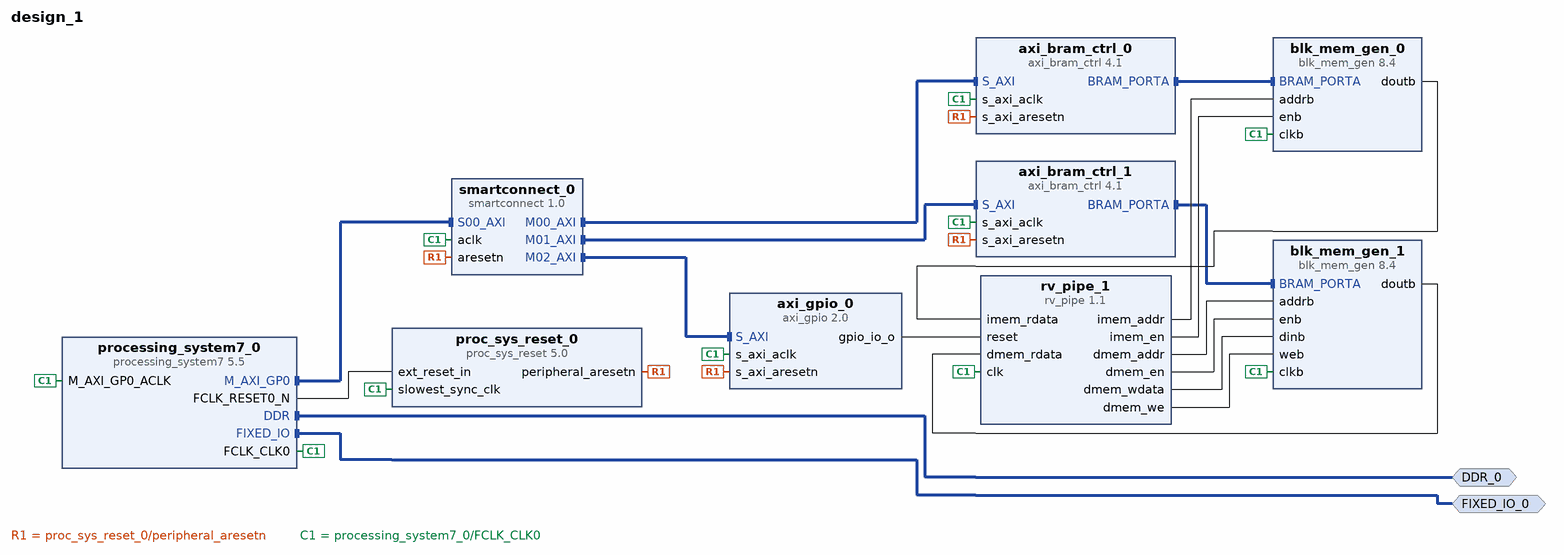
[diagram p0: block diagram of the top level]
# Vivado block design design_1, xc7z020clg400-1, Vivado 2021.2
create_bd_design design_1

create_bd_intf_port -mode Master -vlnv xilinx.com:interface:ddrx_rtl:1.0 DDR_0
create_bd_intf_port -mode Master -vlnv xilinx.com:display_processing_system7:fixedio_rtl:1.0 FIXED_IO_0

create_bd_cell -type ip -vlnv xilinx.com:ip:processing_system7:5.5 processing_system7_0
# 1 more settings of processing_system7_0 are not shown: defaults, MIO pin electricals, DDR timing, and values the tool derives
create_bd_cell -type ip -vlnv xilinx.com:ip:proc_sys_reset:5.0 proc_sys_reset_0
create_bd_cell -type ip -vlnv xilinx.com:ip:smartconnect:1.0 smartconnect_0
set_property -dict {CONFIG.NUM_MI 3 CONFIG.NUM_SI 1} [get_bd_cells smartconnect_0]
create_bd_cell -type ip -vlnv xilinx.com:ip:axi_bram_ctrl:4.1 axi_bram_ctrl_0
set_property -dict {CONFIG.SINGLE_PORT_BRAM 1} [get_bd_cells axi_bram_ctrl_0]
create_bd_cell -type ip -vlnv xilinx.com:ip:axi_bram_ctrl:4.1 axi_bram_ctrl_1
set_property -dict {CONFIG.SINGLE_PORT_BRAM 1} [get_bd_cells axi_bram_ctrl_1]
create_bd_cell -type ip -vlnv xilinx.com:ip:axi_gpio:2.0 axi_gpio_0
set_property -dict {CONFIG.C_ALL_OUTPUTS 1 CONFIG.C_GPIO_WIDTH 1} [get_bd_cells axi_gpio_0]
create_bd_cell -type ip -vlnv xilinx.com:ip:blk_mem_gen:8.4 blk_mem_gen_0
set_property -dict [list \
  CONFIG.Assume_Synchronous_Clk true \
  CONFIG.Enable_B Use_ENB_Pin \
  CONFIG.Memory_Type True_Dual_Port_RAM \
  CONFIG.Port_B_Clock 100 \
  CONFIG.Port_B_Enable_Rate 100 \
  CONFIG.Port_B_Write_Rate 50 \
  CONFIG.Use_RSTB_Pin true \
] [get_bd_cells blk_mem_gen_0]
create_bd_cell -type ip -vlnv xilinx.com:ip:blk_mem_gen:8.4 blk_mem_gen_1
set_property -dict [list \
  CONFIG.Assume_Synchronous_Clk true \
  CONFIG.Enable_B Use_ENB_Pin \
  CONFIG.Memory_Type True_Dual_Port_RAM \
  CONFIG.Port_B_Clock 100 \
  CONFIG.Port_B_Enable_Rate 100 \
  CONFIG.Port_B_Write_Rate 50 \
  CONFIG.Use_RSTB_Pin true \
] [get_bd_cells blk_mem_gen_1]
create_bd_cell -type ip -vlnv user.org:user:rv_pipe:1.1 rv_pipe_1

# ---- connections ----

connect_bd_intf_net [get_bd_intf_pins blk_mem_gen_0/BRAM_PORTA] [get_bd_intf_pins axi_bram_ctrl_0/BRAM_PORTA]
connect_bd_intf_net [get_bd_intf_pins axi_bram_ctrl_1/BRAM_PORTA] [get_bd_intf_pins blk_mem_gen_1/BRAM_PORTA]
connect_bd_intf_net [get_bd_intf_ports DDR_0] [get_bd_intf_pins processing_system7_0/DDR]
connect_bd_intf_net [get_bd_intf_ports FIXED_IO_0] [get_bd_intf_pins processing_system7_0/FIXED_IO]
connect_bd_intf_net [get_bd_intf_pins processing_system7_0/M_AXI_GP0] [get_bd_intf_pins smartconnect_0/S00_AXI]
connect_bd_intf_net [get_bd_intf_pins smartconnect_0/M00_AXI] [get_bd_intf_pins axi_bram_ctrl_0/S_AXI]
connect_bd_intf_net [get_bd_intf_pins smartconnect_0/M01_AXI] [get_bd_intf_pins axi_bram_ctrl_1/S_AXI]
connect_bd_intf_net [get_bd_intf_pins smartconnect_0/M02_AXI] [get_bd_intf_pins axi_gpio_0/S_AXI]
connect_bd_net [get_bd_pins axi_gpio_0/gpio_io_o] [get_bd_pins rv_pipe_1/reset]
connect_bd_net [get_bd_pins blk_mem_gen_0/doutb] [get_bd_pins rv_pipe_1/imem_rdata]
connect_bd_net [get_bd_pins blk_mem_gen_1/doutb] [get_bd_pins rv_pipe_1/dmem_rdata]
connect_bd_net [get_bd_pins proc_sys_reset_0/peripheral_aresetn] \
  [get_bd_pins smartconnect_0/aresetn] [get_bd_pins axi_bram_ctrl_0/s_axi_aresetn] \
  [get_bd_pins axi_bram_ctrl_1/s_axi_aresetn] [get_bd_pins axi_gpio_0/s_axi_aresetn]
connect_bd_net [get_bd_pins processing_system7_0/FCLK_CLK0] \
  [get_bd_pins proc_sys_reset_0/slowest_sync_clk] [get_bd_pins smartconnect_0/aclk] [get_bd_pins axi_bram_ctrl_0/s_axi_aclk] \
  [get_bd_pins axi_bram_ctrl_1/s_axi_aclk] [get_bd_pins axi_gpio_0/s_axi_aclk] [get_bd_pins blk_mem_gen_0/clkb] \
  [get_bd_pins blk_mem_gen_1/clkb] [get_bd_pins processing_system7_0/M_AXI_GP0_ACLK] [get_bd_pins rv_pipe_1/clk]
connect_bd_net [get_bd_pins processing_system7_0/FCLK_RESET0_N] [get_bd_pins proc_sys_reset_0/ext_reset_in]
connect_bd_net [get_bd_pins rv_pipe_1/dmem_addr] [get_bd_pins blk_mem_gen_1/addrb]
connect_bd_net [get_bd_pins rv_pipe_1/dmem_en] [get_bd_pins blk_mem_gen_1/enb]
connect_bd_net [get_bd_pins rv_pipe_1/dmem_wdata] [get_bd_pins blk_mem_gen_1/dinb]
connect_bd_net [get_bd_pins rv_pipe_1/dmem_we] [get_bd_pins blk_mem_gen_1/web]
connect_bd_net [get_bd_pins rv_pipe_1/imem_addr] [get_bd_pins blk_mem_gen_0/addrb]
connect_bd_net [get_bd_pins rv_pipe_1/imem_en] [get_bd_pins blk_mem_gen_0/enb]
set_property HDL_ATTRIBUTE.BMM_INFO_PROCESSOR {arm > design_1 axi_bram_ctrl_0 design_1 axi_bram_ctrl_1} [get_bd_cells processing_system7_0]
set_property HDL_ATTRIBUTE.KEEP_HIERARCHY yes [get_bd_cells processing_system7_0]
set_property HDL_ATTRIBUTE.BMM_INFO_ADDRESS_SPACE {byte  0x40000000 32 > design_1 blk_mem_gen_0} [get_bd_cells axi_bram_ctrl_0]
set_property HDL_ATTRIBUTE.KEEP_HIERARCHY yes [get_bd_cells axi_bram_ctrl_0]
set_property HDL_ATTRIBUTE.BMM_INFO_ADDRESS_SPACE {byte  0x42000000 32 > design_1 blk_mem_gen_1} [get_bd_cells axi_bram_ctrl_1]
set_property HDL_ATTRIBUTE.KEEP_HIERARCHY yes [get_bd_cells axi_bram_ctrl_1]

# ---- address map ----
assign_bd_address -offset 0x40000000 -range 8K -target_address_space [get_bd_addr_spaces processing_system7_0/Data] [get_bd_addr_segs axi_bram_ctrl_0/S_AXI/Mem0]
assign_bd_address -offset 0x41200000 -range 64K -target_address_space [get_bd_addr_spaces processing_system7_0/Data] [get_bd_addr_segs axi_gpio_0/S_AXI/Reg]
assign_bd_address -offset 0x42000000 -range 8K -target_address_space [get_bd_addr_spaces processing_system7_0/Data] [get_bd_addr_segs axi_bram_ctrl_1/S_AXI/Mem0]

validate_bd_design
save_bd_design
